# Altium schematic sheet Logic.SchDoc: Logic Soldeerbout
size A4; DrawnBy: Robbe Th.; Revision: 1; SheetNumber: 4; SheetTotal: 5; Number: PXL_SEM2_SB04R1
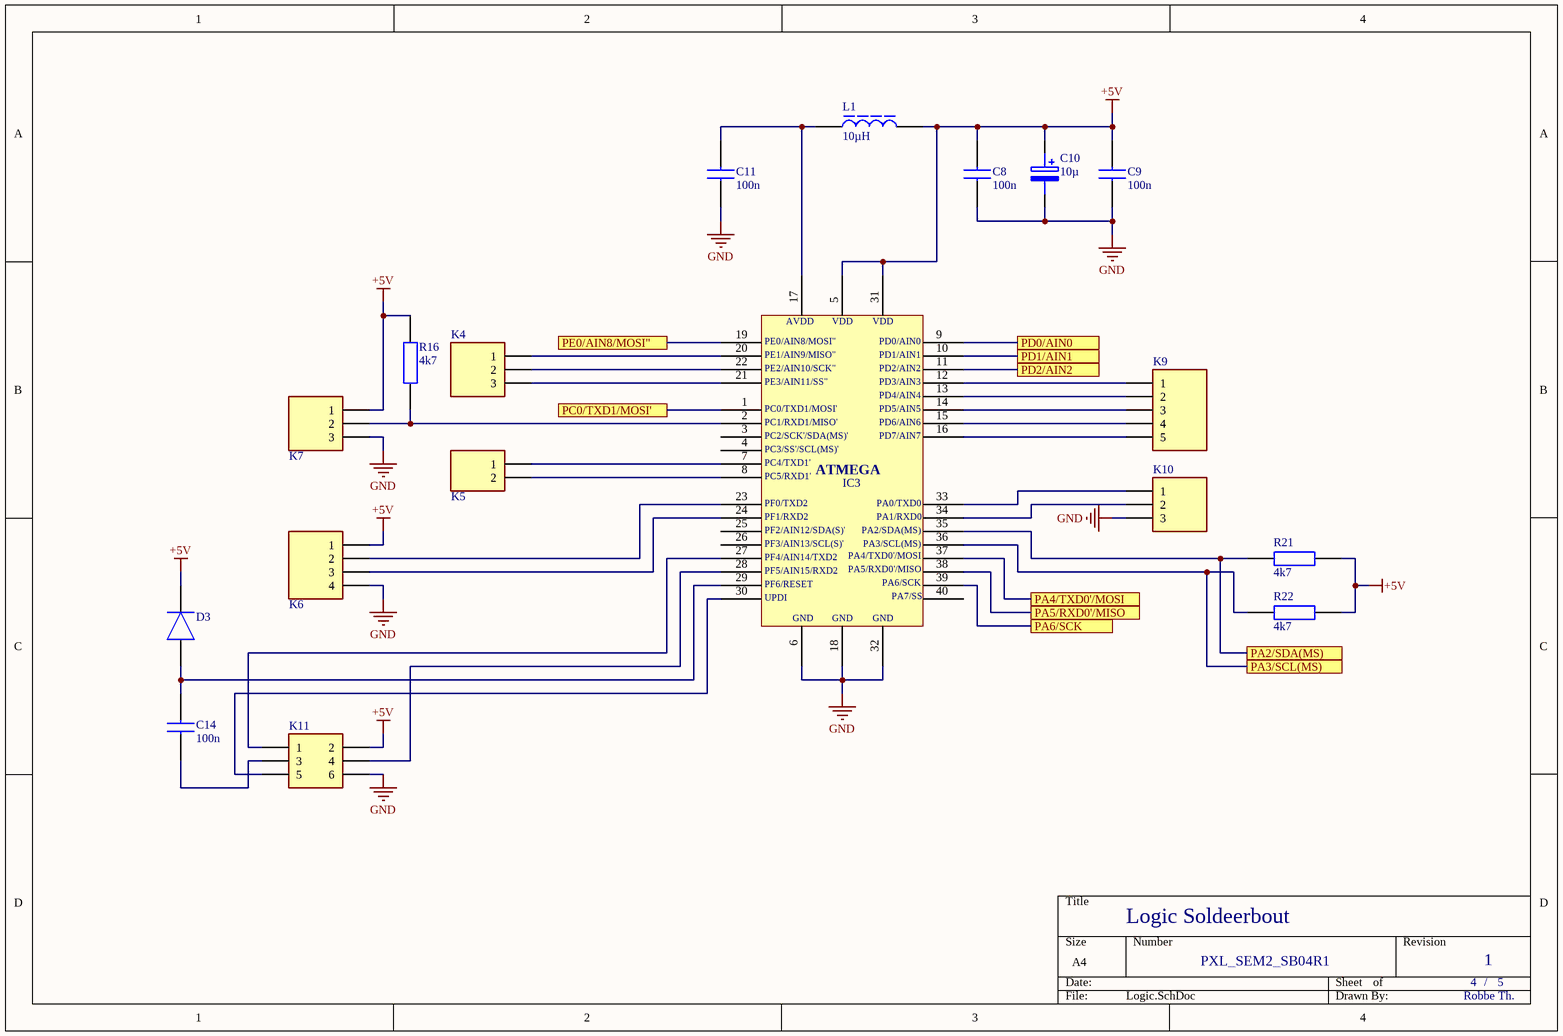
[diagram p0: Logic.SchDoc]

## Parts
C8  100n  [CAPC1005X56N]
C9  100n  [CAPC1005X56N]
C10  10µ  [CAPPRD200W52D500H1250]
C11  100n  [CAPC1005X56N]
C14  100n  [CAPC1005X56N]
D3  SMMDL914T11NG  [SOD2512X110N]  (value not drawn)
IC3  ATMEGA4809-PF  [DIP1543W58P254L5175H635Q40N]  (value not drawn)
K4  M20-9990345  [HDRV3W64P0X254_1X3_762X254X864P]  (value not drawn)
K5  M20-9990246  [HDRV2W66P0X254_1X2_508X254X874P]  (value not drawn)
K6  M20-9770446  [HDRV4W64P0X254_1X4_1016X254X834P]  (value not drawn)
K7  M20-9990345  [HDRV3W64P0X254_1X3_762X254X864P]  (value not drawn)
K9  M20-9990545  [HDRV5W64P0X254_1X5_1270X254X864P]  (value not drawn)
K10  M20-9990345  [HDRV3W64P0X254_1X3_762X254X864P]  (value not drawn)
K11  M20-9760342  [HDRV6W66P254_2X3_762X508X830P]  (value not drawn)
L1  10µH  [VLS6045]
R16  4k7  [RESC2012X65N]
R21  4k7  [RESC2012X65N]
R22  4k7  [RESC2012X65N]

## Ports
PA2/SDA(MS), PA3/SCL(MS), PA4/TXD0'/MOSI, PA5/RXD0'/MISO, PA6/SCK, PC0/TXD1/MOSI', PD0/AIN0, PD1/AIN1, PD2/AIN2, PE0/AIN8/MOSI"

## Nets
+5V: C8.2 C9.2 C10.1(+) D3.1(K) IC3.5 IC3.31 K6.1 K7.1 K11.2 L1.2 R16.2 R21.2 R22.2
GND: C8.1 C9.1 C10.2(-) C11.1 IC3.6 IC3.18 IC3.32 K6.4 K7.3 K10.3 K11.6
PA2/SDA(MS): IC3.35 R21.1 ; port PA2/SDA(MS)
PA3/SCL(MS): IC3.36 R22.1 ; port PA3/SCL(MS)
PA4/TXD0'/MOSI: IC3.37 ; port PA4/TXD0'/MOSI
PA5/RXD0'/MISO: IC3.38 ; port PA5/RXD0'/MISO
PA6/SCK: IC3.39 ; port PA6/SCK
PC0/TXD1/MOSI': IC3.1 ; port PC0/TXD1/MOSI'
PD0/AIN0: IC3.9 ; port PD0/AIN0
PD1/AIN1: IC3.10 ; port PD1/AIN1
PD2/AIN2: IC3.11 ; port PD2/AIN2
PE0/AIN8/MOSI": IC3.19 ; port PE0/AIN8/MOSI"
NetC11_2: C11.2 IC3.17 L1.1
NetC14_1: C14.1 K11.3
NetC14_2: C14.2 D3.2(A) IC3.29
NetIC3_2: IC3.2 K7.2 R16.1
NetIC3_7: IC3.7 K5.1
NetIC3_8: IC3.8 K5.2
NetIC3_12: IC3.12 K9.1
NetIC3_13: IC3.13 K9.2
NetIC3_14: IC3.14 K9.3
NetIC3_15: IC3.15 K9.4
NetIC3_16: IC3.16 K9.5
NetIC3_20: IC3.20 K4.1
NetIC3_21: IC3.21 K4.3
NetIC3_22: IC3.22 K4.2
NetIC3_23: IC3.23 K6.2
NetIC3_24: IC3.24 K6.3
NetIC3_27: IC3.27 K11.1
NetIC3_28: IC3.28 K11.4
NetIC3_30: IC3.30 K11.5
NetIC3_33: IC3.33 K10.1
NetIC3_34: IC3.34 K10.2

Not connected (* = marked no-connect by the designer): IC3 3 4 25 26 40

## Notes on the sheet
- /
- (in symbol ATMEGA4809-PF) AVDD; VDD; PE0/AIN8/MOSI"; PD0/AIN0; PE1/AIN9/MISO"; PD1/AIN1; PE2/AIN10/SCK"; PD2/AIN2; PE3/AIN11/SS"; PD3/AIN3; PD4/AIN4; PC0/TXD1/MOSI'; PD5/AIN5; PC1/RXD1/MISO'; PD6/AIN6; PC2/SCK'/SDA(MS)'; PD7/AIN7; PC3/SS'/SCL(MS)'; PC4/TXD1'; ATMEGA; PC5/RXD1'; PF0/TXD2; PA0/TXD0; PF1/RXD2; PA1/RXD0; PF2/AIN12/SDA(S)'; PA2/SDA(MS); PF3/AIN13/SCL(S)'; PA3/SCL(MS); PF4/AIN14/TXD2; PA4/TXD0'/MOSI; PF5/AIN15/RXD2; PA5/RXD0'/MISO; PF6/RESET; PA6/SCK; UPDI; PA7/SS; GND

## Library data of the parts
C8 C9 C11 C14 = 0402YC104MAT2A: Capacitor SMD 0805; Manufacturer_Name: AVX; Datasheet Link: http://www.mouser.com/catalog/supplier/library/pdf/AVXSurfaceMountCeramic.pdf; Height: 0.56mm; Manufacturer_Part_Number: 0402YC104MAT2A; Mouser Part Number: 581-0402YC104MAT2A; Mouser Price/Stock: https://www.mouser.co.uk/ProductDetail/AVX/0402YC104MAT2A?qs=O2%2FeDh0sX9yiCaLwpXy1bw%3D%3D
C10 = 860020672010: ELCO 10 uF; Manufacturer_Name: Wurth Elektronik; Datasheet Link: https://katalog.we-online.de/pbs/datasheet/860020672010.pdf; Height: 12.5mm; Manufacturer_Part_Number: 860020672010; Mouser Part Number: 710-860020672010; Mouser Price/Stock: https://www.mouser.co.uk/ProductDetail/Wurth-Elektronik/860020672010?qs=0KOYDY2FL2%252BaHkqkc1q4lw%3D%3D
D3 = SMMDL914T1G: Diode 100V 200mA 4ns; Manufacturer_Name: ON Semiconductor; Datasheet Link: https://www.onsemi.com/pub/Collateral/MMDL914T1-D.PDF; Height: 1.1mm; Manufacturer_Part_Number: SMMDL914T1G; Mouser Part Number: 863-SMMDL914T1G; Mouser Price/Stock: https://www.mouser.co.uk/ProductDetail/onsemi/SMMDL914T1G?qs=3PKVEWFFm2%252B2VboGvGtVUg%3D%3D; Arrow Part Number: SMMDL914T1G; Arrow Price/Stock: https://www.arrow.com/en/products/smmdl914t1g/on-semiconductor
IC3 = ATMEGA4809-PF: 8-bit MCU; Manufacturer_Name: Microchip; Datasheet Link: http://ww1.microchip.com/downloads/en/DeviceDoc/40-pin-Data-Sheet-megaAVR-0-series-DS40002104A.pdf; Height: 6.35mm; Manufacturer_Part_Number: ATMEGA4809-PF; Mouser Part Number: 556-ATMEGA4809-PF; Mouser Price/Stock: https://www.mouser.co.uk/ProductDetail/Microchip-Technology-Atmel/ATMEGA4809-PF?qs=T3oQrply3y9UlpZbCygk%252BQ%3D%3D
K4 K7 K10 = M20-9990345: 1R 3P Connector; Manufacturer_Name: Harwin; Datasheet Link: https://cdn.harwin.com/pdfs/M20-999.pdf; Height: 8.64mm; Manufacturer_Part_Number: M20-9990345; Mouser Part Number: 855-M20-9990345; Mouser Price/Stock: https://www.mouser.co.uk/ProductDetail/Harwin/M20-9990345?qs=ulE8k0yEMYbl6ZPCtNdmpA%3D%3D
K5 = M20-9990246: 1R 2P Connector; Manufacturer_Name: Harwin; Datasheet Link: https://cdn.harwin.com/pdfs/M20-999.pdf; Height: 8.74mm; Manufacturer_Part_Number: M20-9990246; Mouser Part Number: 855-M20-9990246; Mouser Price/Stock: https://www.mouser.co.uk/ProductDetail/Harwin/M20-9990246?qs=Jph8NoUxIfWjw4WmyRvzag%3D%3D
K6 = M20-9770446: 1R 4P Connector; Manufacturer_Name: Harwin; Datasheet Link: https://componentsearchengine.com/Datasheets/1/M20-9770446.pdf; Height: 8.34mm; Manufacturer_Part_Number: M20-9770446; Mouser Part Number: 855-M20-9770446; Mouser Price/Stock: https://www.mouser.co.uk/ProductDetail/Harwin/M20-9770446?qs=ulE8k0yEMYbCPpMPHeYh4w%3D%3D
K9 = M20-9990545: 1R 5P Connector; Manufacturer_Name: Harwin; Datasheet Link: https://componentsearchengine.com/Datasheets/2/M20-9990545.pdf; Height: 8.64mm; Manufacturer_Part_Number: M20-9990545; Mouser Part Number: 855-M20-9990545; Mouser Price/Stock: https://www.mouser.co.uk/ProductDetail/Harwin/M20-9990545?qs=ulE8k0yEMYY1AaFSSzjXzw%3D%3D
K11 = M20-9760342: 2R 6P Connector; Manufacturer_Name: Harwin; Datasheet Link: https://cdn.harwin.com/pdfs/M20-976.pdf; Height: 8.3mm; Manufacturer_Part_Number: M20-9760342; Mouser Part Number: 855-M20-9760342; Mouser Price/Stock: https://www.mouser.co.uk/ProductDetail/Harwin/M20-9760342/?qs=%252Bk6%2F5FB6qrkaVmYIHZO6zg%3D%3D
L1 = VLS6045EX-100M-H: Smoorspoel 10uH; Manufacturer_Name: TDK; Datasheet Link: https://product.tdk.com/system/files/dam/doc/product/inductor/inductor/smd/catalog/inductor_automotive_power_vls6045ex-h_en.pdf; Manufacturer_Part_Number: VLS6045EX-100M-H; Mouser Part Number: 810-VLS6045EX-100M-H; Mouser Price/Stock: https://www.mouser.co.uk/ProductDetail/TDK/VLS6045EX-100M-H?qs=qSfuJ%252Bfl%2Fd6r84tw2EUg2Q%3D%3D; Arrow Part Number: VLS6045EX-100M-H; Arrow Price/Stock: https://www.arrow.com/en/products/vls6045ex-100m-h/tdk?region=nac
R16 R21 R22 = CPF0805B100RE1: Resistor SMD 0805; Manufacturer_Name: TE Connectivity; Datasheet Link: https://datasheet.datasheetarchive.com/originals/distributors/DKDS-21/401696.pdf; Height: 0.65mm; Manufacturer_Part_Number: CPF0805B100RE1; Mouser Part Number: 279-CPF0805B100RE1; Mouser Price/Stock: https://www.mouser.co.uk/ProductDetail/TE-Connectivity-Holsworthy/CPF0805B100RE1?qs=9ylKvqdyudkCWLPT1QvLZQ%3D%3D; Arrow Part Number: CPF0805B100RE1; Arrow Price/Stock: https://www.arrow.com/en/products/cpf0805b100re1/te-connectivity?region=nac